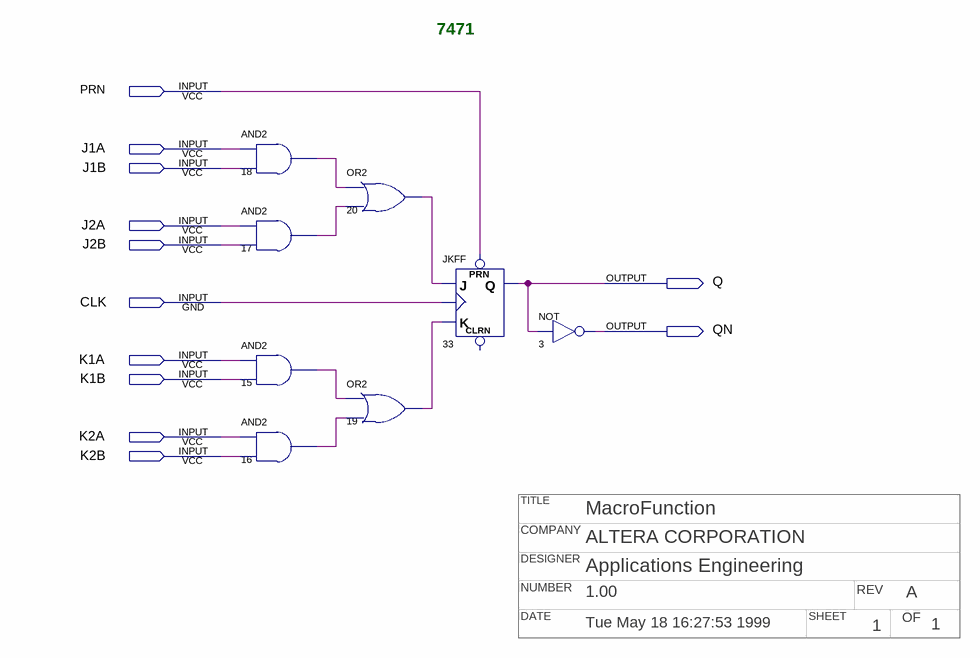
[diagram p0: schematic sheet]
// Quartus schematic 7471.bdf as structural Verilog: 8 symbols, 12 pins
// Title block: TITLE: MacroFunction; COMPANY: ALTERA CORPORATION; DESIGNER: Applications Engineering; NUMBER: 1.00; REV: A; DATE: Tue May 18 16:27:53 1999; SHEET: 1; OF: 1
module \7471  (
  input  PRN,
  input  J1A,
  input  J1B,
  input  J2A,
  input  J2B,
  input  CLK,
  input  K1A,
  input  K1B,
  input  K2A,
  input  K2B,
  output Q,
  output QN
);

  wire n15_out, n16_out, n17_out, n18_out, n19_out, n20_out;

  and u_18 (n18_out, J1A, J1B);
  and u_17 (n17_out, J2A, J2B);
  and u_15 (n15_out, K1A, K1B);
  and u_16 (n16_out, K2A, K2B);
  or u_20 (n20_out, n18_out, n17_out);
  or u_19 (n19_out, n15_out, n16_out);
  JKFF u_33 (.PRN(PRN), .K(n19_out), .J(n20_out), .CLK(CLK), .Q(Q));  // open: CLRN
  not u_3 (QN, Q);

  // Notes on the sheet:
  //   7471
endmodule
